# Altium schematic sheet 2_MCU.SchDoc
size A3; DocumentNumber: 3; SheetNumber: 3; SheetTotal: 6; PageSetup: Record=PageOptions|CenterHorizontal=True|CenterVertical=True|PrintScale=1.01|XCorrection=1.00|YCorrection=1.00|PrintKind=0|BorderSize=5000000|LeftOffset=0|BottomOffset=0|Orientation=2|PaperLength=1000|PaperWidth=1000|Scale=100|PaperSource=7|PrintQuality=-4|MediaType=1|DitherType=10|PaperKind=A3|PrintScaleMode=1
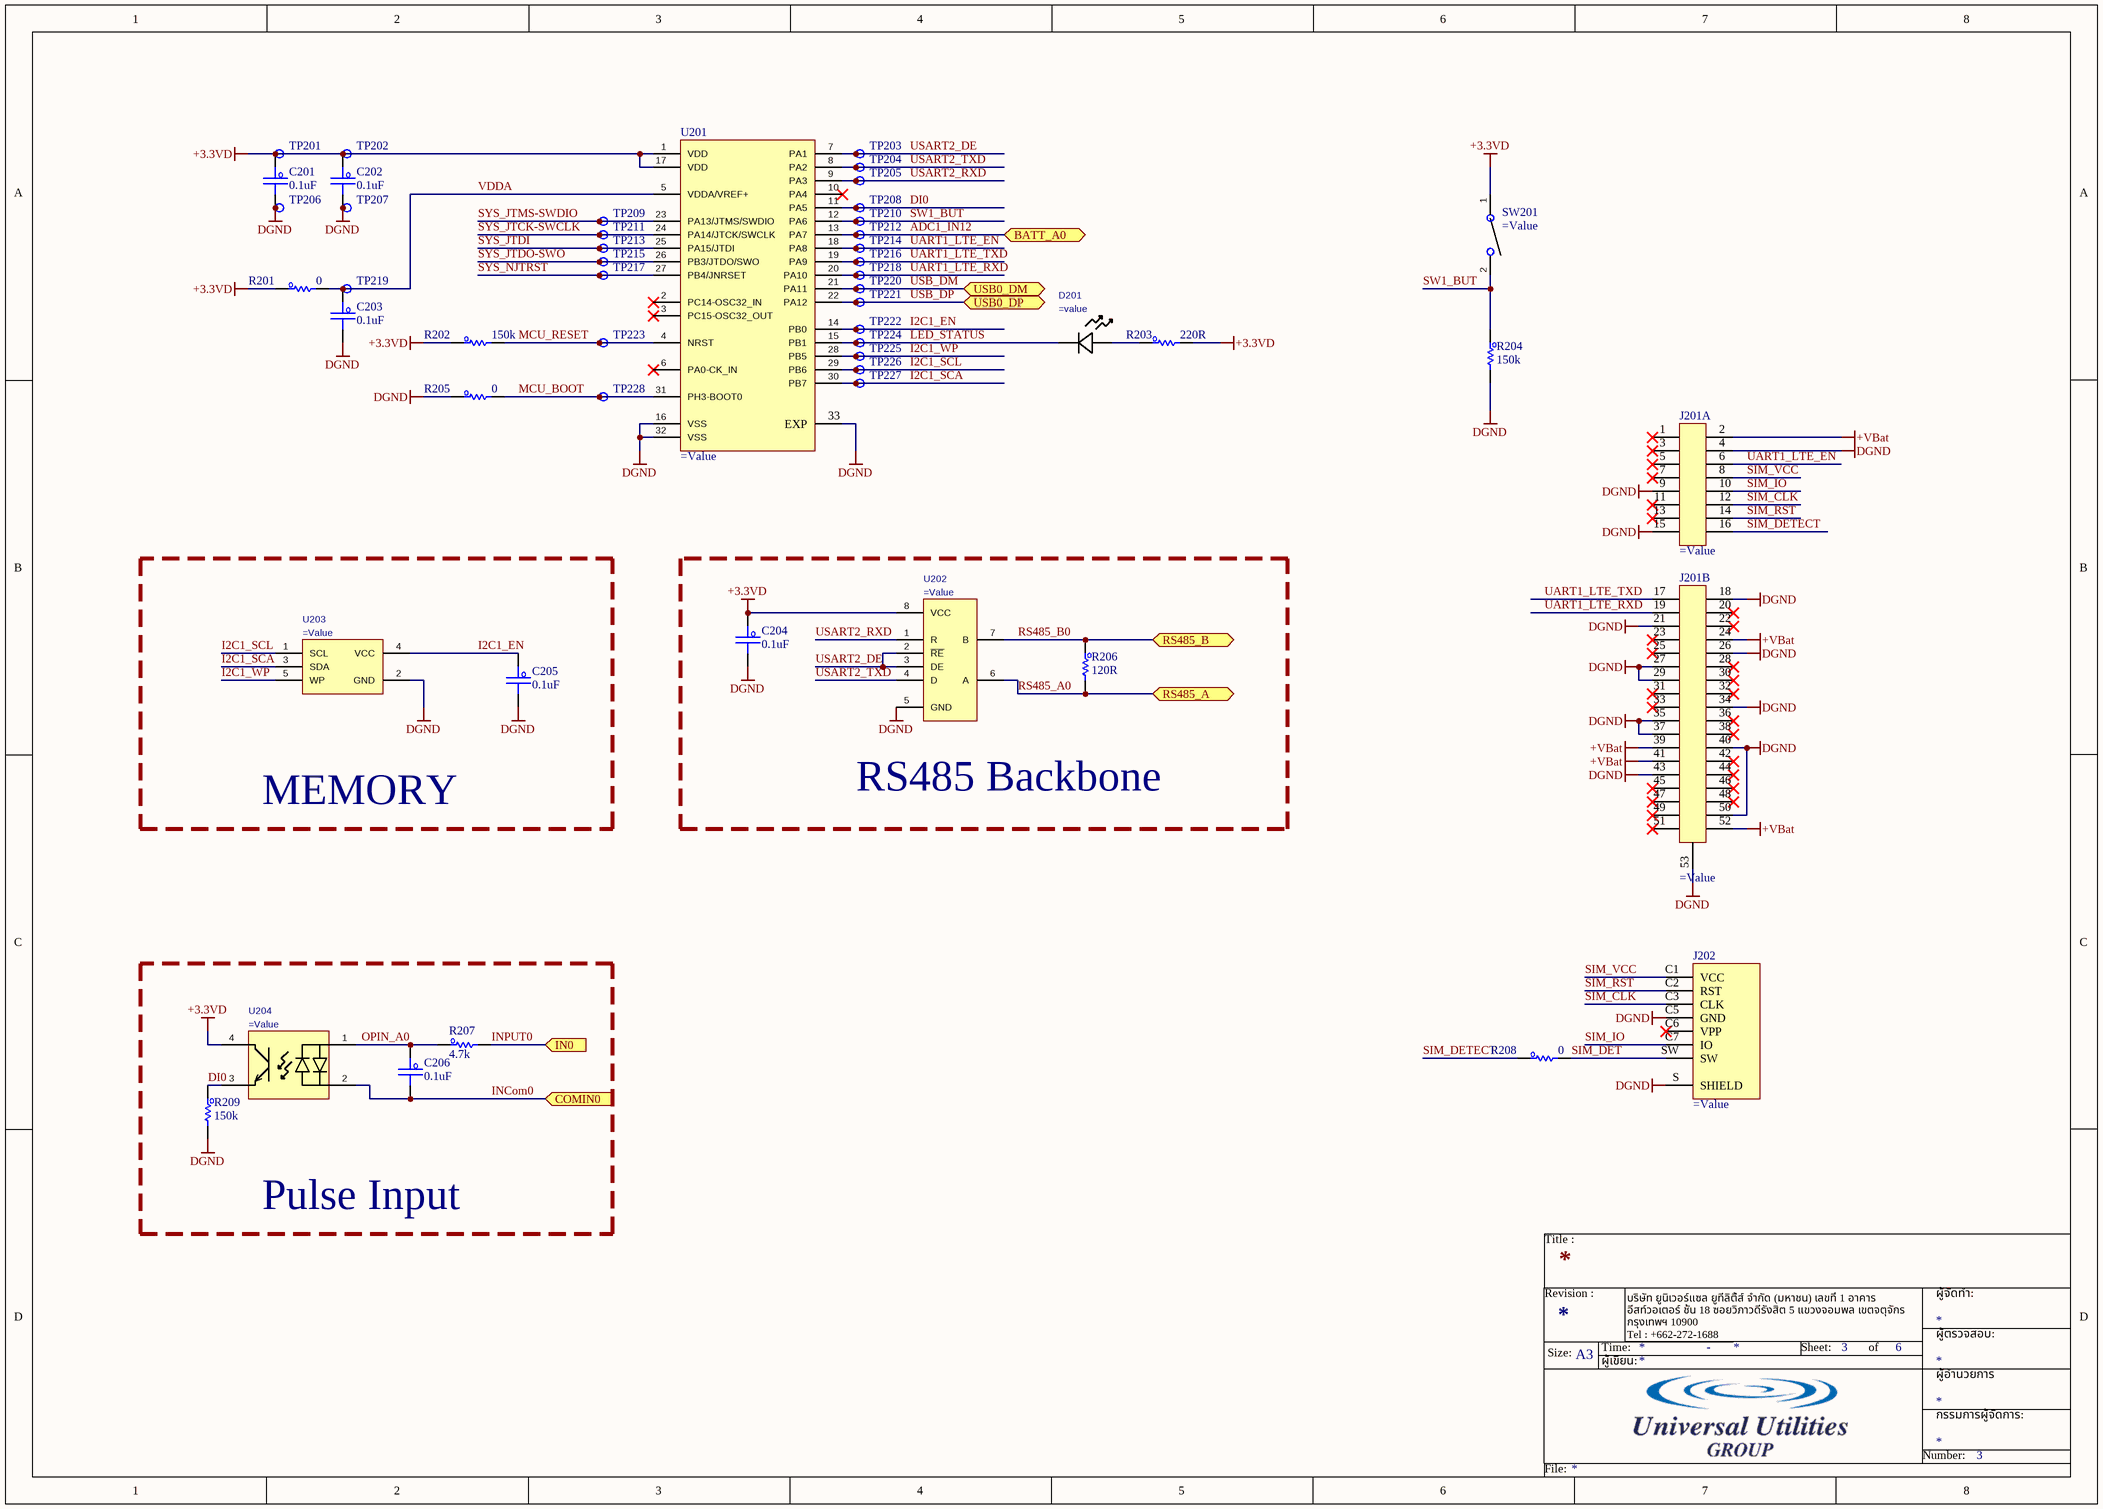
[diagram p0: 2_MCU.SchDoc]

## Parts
C201  0.1uF  [C_0603]
C202  0.1uF  [C_0603]
C203  0.1uF  [C_0603]
C204  0.1uF  [C_0603]
C205  0.1uF  [C_0603]
C206  0.1uF  [C_0603]
D201  (no value)  [LED_0VS75000_WRE]
J201  (no value)  [TE_2041119-1]  (parts A,B of 2)
J202  (no value)  [SIM8060-6-1-14-00-A_REVA]
R201  0  [R_0603]
R202  150k  [R_0603]
R203  220R  [R_0603]
R204  150k  [R_0603]
R205  0  [R_0603]
R206  120R  [R_0603]
R207  4.7k  [R_0603]
R208  0  [R_0603]
R209  150k  [R_0603]
SW201  (no value)  [SW_KSS241GLFS_CN]
TP201  (no value)  [TP_Testpoint]  (no BOM)
TP202  (no value)  [TP_Testpoint]  (no BOM)
TP203  (no value)  [TP_Testpoint]  (no BOM)
TP204  (no value)  [TP_Testpoint]  (no BOM)
TP205  (no value)  [TP_Testpoint]  (no BOM)
TP206  (no value)  [TP_Testpoint]  (no BOM)
TP207  (no value)  [TP_Testpoint]  (no BOM)
TP208  (no value)  [TP_Testpoint]  (no BOM)
TP209  (no value)  [TP_Testpoint]  (no BOM)
TP210  (no value)  [TP_Testpoint]  (no BOM)
TP211  (no value)  [TP_Testpoint]  (no BOM)
TP212  (no value)  [TP_Testpoint]  (no BOM)
TP213  (no value)  [TP_Testpoint]  (no BOM)
TP214  (no value)  [TP_Testpoint]  (no BOM)
TP215  (no value)  [TP_Testpoint]  (no BOM)
TP216  (no value)  [TP_Testpoint]  (no BOM)
TP217  (no value)  [TP_Testpoint]  (no BOM)
TP218  (no value)  [TP_Testpoint]  (no BOM)
TP219  (no value)  [TP_Testpoint]  (no BOM)
TP220  (no value)  [TP_Testpoint]  (no BOM)
TP221  (no value)  [TP_Testpoint]  (no BOM)
TP222  (no value)  [TP_Testpoint]  (no BOM)
TP223  (no value)  [TP_Testpoint]  (no BOM)
TP224  (no value)  [TP_Testpoint]  (no BOM)
TP225  (no value)  [TP_Testpoint]  (no BOM)
TP226  (no value)  [TP_Testpoint]  (no BOM)
TP227  (no value)  [TP_Testpoint]  (no BOM)
TP228  (no value)  [TP_Testpoint]  (no BOM)
U201  (no value)  [QFN50P500X500X60-33N]
U202  (no value)  [D0008A_L]
U203  (no value)  [SOT65P210X110-5N]
U204  (no value)  [SOIC_M618A-3T_VI]

## Blocks framed on the sheet
MEMORY: C205 U203
RS485 Backbone: C204 R206 U202
Pulse Input: C206 R207 R209 U204

## Ports
BATT_A0 (bidir), COMIN0 (in), IN0 (in), RS485_A (bidir), RS485_B (bidir), USB0_DM (bidir), USB0_DP (bidir)

## Nets
+3.3VD: C201.1 C202.1 C204.1 R201.1 R202.1 R203.2 SW201.1 TP201.1 TP202.1 U201.1(VDD) U201.17(VDD) U202.8(VCC) U204.4(C)
+VBat: J201.2 J201.24 J201.39 J201.41 J201.52
DGND: C201.2 C202.2 C203.2 C204.2 C205.2 J201.4 J201.9 J201.15 J201.18 J201.21 J201.26 J201.27 J201.29 J201.34 J201.35 J201.37 J201.40 J201.43 J201.50 J201.53 J202.C5(GND) J202.S(SHIELD) R204.2 R205.1 R209.2 TP206.1 TP207.1 U201.16(VSS) U201.32(VSS) U201.33(EXP) U202.5(GND) U203.2(GND)
ADC1_IN12: TP212.1 U201.13(PA7) ; port BATT_A0
DI0: R209.1 TP208.1 U201.11(PA5) U204.3(E)
I2C1_EN: C205.1 TP222.1 U201.14(PB0) U203.4(VCC)
I2C1_SCA: TP227.1 U201.30(PB7) U203.3(SDA)
I2C1_SCL: TP226.1 U201.29(PB6) U203.1(SCL)
I2C1_WP: TP225.1 U201.28(PB5) U203.5(WP)
INCom0: C206.2 U204.2(C_2) ; port COMIN0
INPUT0: R207.2 ; port IN0
LED_STATUS: D201.2 TP224.1 U201.15(PB1)
MCU_BOOT: R205.2 TP228.1 U201.31(PH3-BOOT0)
MCU_RESET: R202.2 TP223.1 U201.4(NRST)
OPIN_A0: C206.1 R207.1 U204.1(A)
RS485_A0: R206.2 U202.6(A) ; port RS485_A
RS485_B0: R206.1 U202.7(B) ; port RS485_B
SIM_CLK: J201.12 J202.C3(CLK)
SIM_DET: J202.SW R208.2
SIM_DETECT: J201.16 R208.1
SIM_IO: J201.10 J202.C7(IO)
SIM_RST: J201.14 J202.C2(RST)
SIM_VCC: J201.8 J202.C1(VCC)
SW1_BUT: R204.1 SW201.2 TP210.1 U201.12(PA6)
SYS_JTCK-SWCLK: TP211.1 U201.24(PA14/JTCK/SWCLK)
SYS_JTDI: TP213.1 U201.25(PA15/JTDI)
SYS_JTDO-SWO: TP215.1 U201.26(PB3/JTDO/SWO)
SYS_JTMS-SWDIO: TP209.1 U201.23(PA13/JTMS/SWDIO)
SYS_NJTRST: TP217.1 U201.27(PB4/JNRSET)
UART1_LTE_EN: J201.6 TP214.1 U201.18(PA8)
UART1_LTE_RXD: J201.19 TP218.1 U201.20(PA10)
UART1_LTE_TXD: J201.17 TP216.1 U201.19(PA9)
USART2_DE: TP203.1 U201.7(PA1) U202.2(~{RE}) U202.3(DE)
USART2_RXD: TP205.1 U201.9(PA3) U202.1(R)
USART2_TXD: TP204.1 U201.8(PA2) U202.4(D)
USB_DM: TP220.1 U201.21(PA11) ; port USB0_DM
USB_DP: TP221.1 U201.22(PA12) ; port USB0_DP
VDDA: C203.1 R201.2 TP219.1 U201.5(VDDA/VREF+)
NetD201_1: D201.1 R203.1

Not connected (* = marked no-connect by the designer): J201 1* 3* 5* 7* 11* 13* 20* 22* 23* 25* 28* 30* 31* 32* 33* 36* 38* 42* 44* 45* 46* 47* 48* 49* 51*; J202 C6(VPP)*; U201 2(PC14-OSC32_IN)* 3(PC15-OSC32_OUT)* 6(PA0-CK_IN)* 10(PA4)*

## Notes on the sheet
- Title :
- Revision :
- ผู้จัดทำ:
- Size:
- A3
- Time:
- ผู้เขียน:
- บริษัท ยูนิเวอร์แซล ยูทีลิตี้ส์ จำกัด (มหาชน) เลขที่ 1 อาคาร อีสท์วอเตอร์ ชั้น 18 ซอยวิภาวดีรังสิต 5 แขวงจอมพล เขตจตุจักร กรุงเทพฯ 10900
  Tel : +662-272-1688
  Fax :+662-2721690-1
- -
- Sheet:
- of
- ผู้อำนวยการ
- ผู้ตรวจสอบ:
- Number:
- กรรมการผู้จัดการ:
- File:

## Library data of the parts
C201-C206 = C_Capacitor: CAP CER 0.1UF 50V X7R 0603; Manufacturer: KEMET; PartNumber: C0603C104K5RACTU; PackageReference: 0603; PartID: 399-5089-1-ND; Value2: 50V; Value: 0.1uF; Value3: *
D201 = D_LED_150060BS75000: LED BLUE CLEAR 0603 SMD; Manufacturer: Wurth Electronics; Value: 150060VS75000; PackageReference: 0603; PartID: 732-4980-1-ND; PartNumber: 150060VS75000
J201 = CON_PCI-E-52P: CONN PCI EXP MINI FEMALE 52POS; PartNumber: 2041119-1; Manufacturer: TE Connectivity AMP Connectors; Value: 2041119-1; PartID: A108265CT-ND; PackageReference: *; Value2: *; Value3: *
J202 = CON_SIM_Nano_Top: CONN SIM NANO HINGED 6P W/SWITCH; PartNumber: SIM8060-6-1-14-00-A; Manufacturer: GCT; Value: SIM8060-6-1-14-00-A; PartID: 640-SIM8060611400A; PackageReference: *; Value2: *; Value3: *
R201 R205 R208 = R_Resister: RES SMD 0 OHM JUMP 1/10W 0603; Manufacturer: Vishay Dale; PartNumber: CRCW06030000Z0EBC; Value2: 0.1W; Value: 0; PackageReference: 0603; PartID: 541-4013-1-ND; Value3: *
R202 R204 R209 = R_Resister: RES SMD 150K OHM 1% 1/10W 0603; Manufacturer: Vishay Dale; PartNumber: CRCW0603150KFKEAC; Value2: 0.1W; Value: 150k; PackageReference: 0603; PartID: 541-4034-1-ND; Value3: *
R203 = R_Resister: RES SMD 220 OHM 1% 1/10W 0603; Manufacturer: Vishay Dale; PartNumber: CRCW0603220RFKEAC; Value2: 0.1W; Value: 220R; PackageReference: 0603; PartID: 541-4047-1-ND; Value3: *
R206 = R_Resister: RES SMD 120 OHM 1% 1/3W 0603; Manufacturer: Vishay Dale; PartNumber: CRCW0603120RFKEAHP; Value2: 0.333W; Value: 120R; PackageReference: 0603; PartID: 541-120SCT-ND; Value3: *
R207 = R_Resister: RES 4.7K OHM 5% 1/10W 0603; Manufacturer: Vishay Dale; PartNumber: CRCW06034K70JNEBC; Value2: 0.1W; Value: 4.7k; PackageReference: 0603; PartID: 541-CRCW06034K70JNEBCCT-ND; Value3: *
SW201 = SW_TAC: SWITCH TACTILE SPST-NO 0.05A 50V; PartNumber: KSS241GLFS; Manufacturer: C&K; Value: KSS241GLFS; PartID: 401-1099-1-ND; PackageReference: *; Value2: *; Value3: *
TP201-TP228 = TP_TestPoint: TestPoint; Manufacturer: *; PackageReference: *; PartID: *; PartNumber: *; Value2: *; Value3: *
U201 = IC_MCU_STM32L432: IC MCU 32BIT 256KB FLSH 32UFQFPN; PartNumber: STM32L432KCU6; Manufacturer: STMicroelectronics; Value: STM32L432KCU6; PartID: 497-16578-ND; PackageReference: *; Value2: *; Value3: *
U202 = IC_TRAN_THVD1505DR: IC TRANSCEIVER HALF 1/1 8SOIC; Manufacturer: Texas Instruments; PartNumber: SN65HVD11DR; Value: SN65HVD11DR; PackageReference: 8SOIC; PartID: 0086-0766-1; Value3: SN65HVD11DR
U203 = IC_MEM_24AA02HT: IC EEPROM 2KBIT I2C SC70-5; Manufacturer: Microchip Technology; Value: 24AA02HT-I/LT; PackageReference: SC-70-5; PartID: 24AA02HT-I/LTCT-ND; PartNumber: 24AA02HT-I/LT
U204 = IC_OPTO_LTV-814S-TA1: OPTOISOLATR 5KV TRANSISTOR 4-SMD; Manufacturer: Lite-On Inc.; Value: LTV-814S-TA1; PackageReference: 4-SOP; PartID: 160-1891-1-ND; PartNumber: LTV-814S-TA1